# Altium schematic sheet PWM.SchDoc
size A4
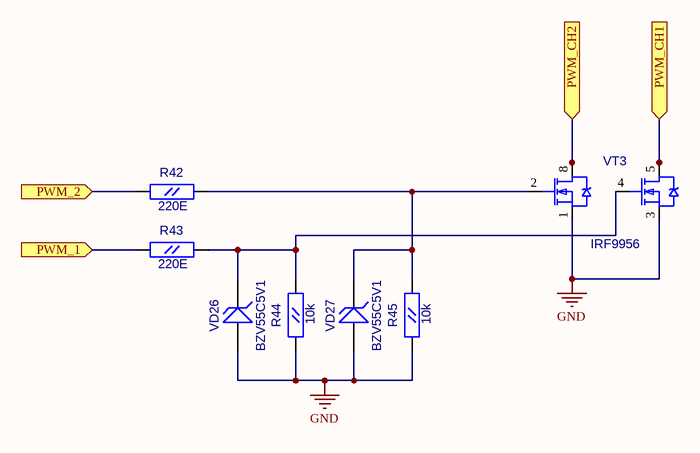
[diagram p0: PWM.SchDoc]

## Parts
R42  220E  [RC0603]
R43  220E  [RC0603]
R44  10k  [RC0603]
R45  10k  [RC0603]
VD26  BZV55C5V1  [SOD-80]
VD27  BZV55C5V1  [SOD-80]
VT3  IRF9956  [SO-8]

## Ports
PWM_1 (in), PWM_2 (in), PWM_CH1 (in), PWM_CH2 (in)

## Nets
GND: R44.1(A) R45.1(A) VD26.1(A) VD27.1(A) VT3.1(S) VT3.3(S)
PWM_1: R43.1(A) ; port PWM_1
PWM_2: R42.1(A) ; port PWM_2
PWM_CH1: VT3.5(D) VT3.6(D) ; port PWM_CH1
PWM_CH2: VT3.7(D) VT3.8(D) ; port PWM_CH2
NetR42_2: R42.2(B) R45.2(B) VD27.2 VT3.2(G)
NetR43_2: R43.2(B) R44.2(B) VD26.2 VT3.4(G)

## Library data of the parts
R42-R45 = RC0603
  R42 R43: Value: 220E
  R44 R45: Value: 10k
VD26 VD27 = BZV55C5V1: Zener Voltage Regulator Diode; OriginalName: BZX84C10LT1; ComponentField6: Pin 2 is not connected and not drawn.; ComponentField7: Published 29-Sep-2000; Value: BZV55C5V1
VT3 = IRF9956: HEXFET Power MOSFET; OriginalName: IRLML2402; ComponentField7: Published 8-Jun-2000; Value: IRF9956